# Altium project 剥皮器20200614.PrjPCB
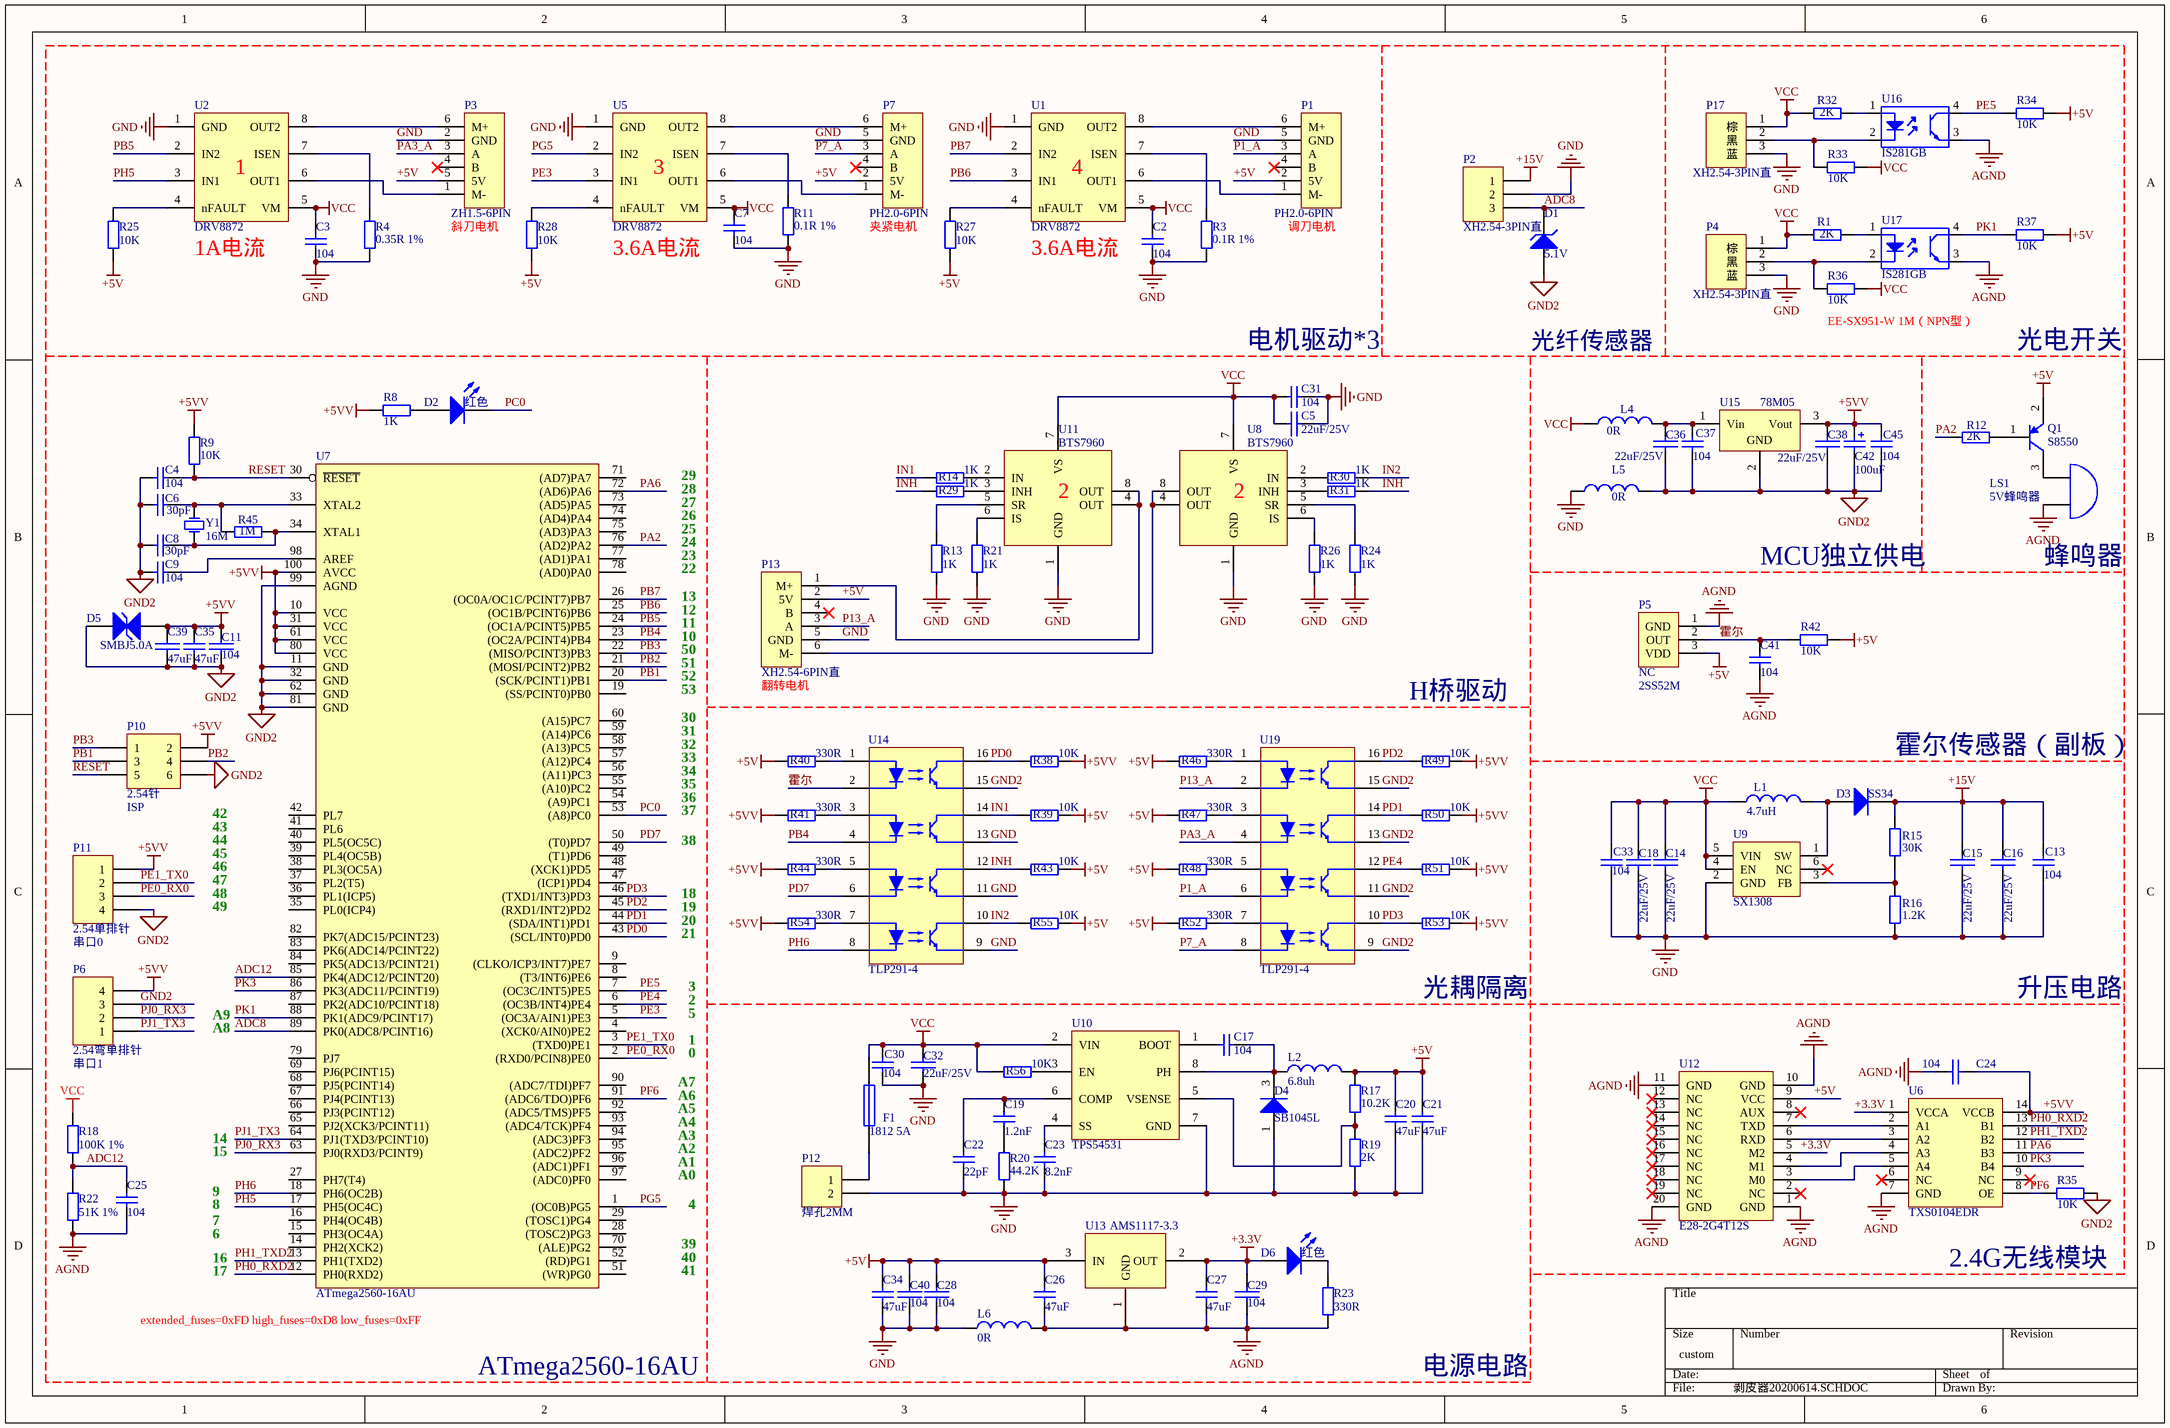
[diagram p0: 剥皮器20200614.SCHDOC]
1 sheet, 134 parts. Net scope: global (net labels, ports and power ports of the same name join across sheets).
Board file: 剥皮器20200614.PCBDOC

## Sheet 剥皮器20200614.SCHDOC
size 406 x 266 mm; PageSetup: Record=PageOptions|CenterHorizontal=True|CenterVertical=True|PrintScale=1.02|XCorrection=1.00|YCorrection=1.00|PrintKind=0|BorderSize=5000000|LeftOffset=0|BottomOffset=0|Orientation=2|PaperLength=1000|PaperWidth=1000|Scale=100|PaperSource=7|PrintQuality=-4|MediaType=1|DitherType=10|PaperKind=A3|PrintScaleMode=1

### Parts
C2  104  [0805-C]
C3  104  [0805-C]
C4  104  [0805-C]
C5  22uF/25V  [1206-C]
C6  30pF  [0805-C]
C7  104  [0805-C]
C8  30pF  [0805-C]
C9  104  [0805-C]
C11  104  [0805-C]
C13  104  [0805-C]
C14  22uF/25V  [1206-C]
C15  22uF/25V  [1206-C]
C16  22uF/25V  [1206-C]
C17  104  [0805-C]
C18  22uF/25V  [1206-C]
C19  1.2nF  [0805-C]
C20  47uF  [0805-C]
C21  47uF  [0805-C]
C22  22pF  [0805-C]
C23  8.2nF  [0805-C]
C24  104  [0805-C]
C25  104  [0805-C]
C26  47uF  [0805-C]
C27  47uF  [0805-C]
C28  104  [0805-C]
C29  104  [0805-C]
C30  104  [0805-C]
C31  104  [0805-C]
C32  22uF/25V  [1206-C]
C33  104  [0805-C]
C34  47uF  [0805-C]
C35  47uF  [0805-C]
C36  22uF/25V  [1206-C]
C37  104  [0805-C]
C38  22uF/25V  [1206-C]
C39  47uF  [0805-C]
C40  104  [0805-C]
C41  104  [0805-C]
C42  100uF  [LC-CASE-C_6032]
C45  104  [0805-C]
D1  5.1V  [LC-LL-34]
D2  红色  [0805-LED]
D3  SS34  [SMA - JW]
D4  SB1045L  [TO-277]
D5  SMBJ5.0A  [LC-SMB(DO-214AA)_S2]
D6  红色  [0805-LED]
F1  1812 5A  [LC-1812_R]
L1  4.7uH  [7*7*4电感]
L2  6.8uh  [7*7*4电感]
L4  0R  [0805-R]
L5  0R  [0805-R]
L6  0R  [0805-R]
LS1  5V蜂鸣器  [蜂鸣器0905]
P1  PH2.0-6PIN  [PH2.0-6PIN]
P2  XH2.54-3PIN直  [XH2.54-3PIN直]
P3  ZH1.5-6PIN  [ZH1.5-6PIN]
P4  XH2.54-3PIN直  [XH2.54-3PIN直]
P5  NC  Publisher: 2SS52M  [TO-92—_三极管]
P6  2.54弯单排针  [HDR1X4H]
P7  PH2.0-6PIN  [PH2.0-6PIN]
P10  2.54针  [HDR2X3]
P11  2.54单排针  [HDR1X4]
P12  焊孔2MM  [HDR1X2]
P13  XH2.54-6PIN直  [XH2.54-6PIN直]
P17  XH2.54-3PIN直  [XH2.54-3PIN直]
Q1  S8550  [SOT--23]
R1  2K  [0805-R]
R3  0.1R 1%  [2512-R]
R4  0.35R 1%  [2512-R]
R8  1K  [0805-R]
R9  10K  [0805-R]
R11  0.1R 1%  [2512-R]
R12  2K  [0805-R]
R13  1K  [0805-R]
R14  1K  [0805-R]
R15  30K  [0805-R]
R16  1.2K  [0805-R]
R17  10.2K  [0805-R]
R18  100K 1%  [0805-R]
R19  2K  [0805-R]
R20  44.2K  [0805-R]
R21  1K  [0805-R]
R22  51K 1%  [0805-R]
R23  330R  [0805-R]
R24  1K  [0805-R]
R25  10K  [0805-R]
R26  1K  [0805-R]
R27  10K  [0805-R]
R28  10K  [0805-R]
R29  1K  [0805-R]
R30  1K  [0805-R]
R31  1K  [0805-R]
R32  2K  [0805-R]
R33  10K  [0805-R]
R34  10K  [0805-R]
R35  10K  [0805-R]
R36  10K  [0805-R]
R37  10K  [0805-R]
R38  10K  [0805-R]
R39  10K  [0805-R]
R40  330R  [0805-R]
R41  330R  [0805-R]
R42  10K  [0805-R]
R43  10K  [0805-R]
R44  330R  [0805-R]
R45  1M  [0805-R]
R46  330R  [0805-R]
R47  330R  [0805-R]
R48  330R  [0805-R]
R49  10K  [0805-R]
R50  10K  [0805-R]
R51  10K  [0805-R]
R52  330R  [0805-R]
R53  10K  [0805-R]
R54  330R  [0805-R]
R55  10K  [0805-R]
R56  10K  [0805-R]
U1  DRV8872  [SOP-8带散热]
U2  DRV8872  [SOP-8带散热]
U5  DRV8872  [SOP-8带散热]
U6  TXS0104EDR  [LC-SOIC-14_150mil]
U7  ATmega2560-16AU  [LC-LQFP-100_14x14x05P]
U8  BTS7960  [LC-TO-263-7]
U9  SX1308  [SOT-23-6]
U10  TPS54531  [SOP-8带散热]
U11  BTS7960  [LC-TO-263-7]
U12  E28-2G4T12S  [E28-2G4T12S]
U13  AMS1117-3.3  [SOT--223]
U14  TLP291-4  [TLP291-4]
U15  78M05  [TO-252]
U16  IS281GB  [LC-SOP-4_P1.27]
U17  IS281GB  [LC-SOP-4_P1.27]
U19  TLP291-4  [TLP291-4]
Y1  16M  [LC-SMD-5032_2P]

### Nets
+3.3V: C27.2 C29.1 D6.1(A) U6.1(VCCA) U12.5(M2) U13.2(OUT)
+5V: C20.2 C21.2 C26.2 C28.1 C34.2 C40.1 L2.2 P1.2(5V) P3.5(5V) P5.3(VDD) P7.2(5V) P13.2(5V) Q1.2(E) R17.2 R25.1 R27.1 R28.1 R34.2 R37.2 R39.1 R40.2 R42.1 R43.1 R46.2 R47.2 R48.2 R52.2 R55.1 U12.9(VCC) U13.3(IN)
+5VV: C11.1 C24.2 C35.2 C38.1 C39.2 C42.1 C45.2 D5.1(A) P6.4 P10.2 P11.1 R8.2 R9.2 R38.1 R41.2 R44.2 R49.1 R50.1 R51.1 R53.1 R54.2 U6.14(VCCB) U7.10(VCC) U7.31(VCC) U7.61(VCC) U7.80(VCC) U7.100(AVCC) U15.3(Vout)
+15V: C13.1 C15.1 C16.1 D3.2(K) P2.1 R15.1
AGND: C24.1 C25.2 C26.1 C27.1 C29.2 C41.2 L6.2 LS1.2(B) P5.1(GND) R22.1 R23.2 U6.7(GND) U12.1(GND) U12.10(GND) U12.11(GND) U12.20(GND) U13.1(GND) U16.3 U17.3
GND: C2.2 C3.2 C5.2 C7.2 C13.2 C14.2 C15.2 C16.2 C18.2 C20.1 C21.1 C22.2 C23.2 C28.2 C30.1 C31.2 C32.2 C33.1 C34.1 C40.2 D4.1(A) L5.1 L6.1 P1.5(GND) P2.2 P3.2(GND) P4.3(蓝) P7.5(GND) P12.2 P13.5(GND) P17.3(蓝) R3.1 R4.1 R11.1 R13.1 R16.2 R19.1 R20.1 R21.1 R24.1 R26.1 U1.1(GND) U2.1(GND) U5.1(GND) U8.1(GND) U9.2(GND) U10.7(GND) U11.1(GND) U14.9(Emitter4) U14.11(Emitter3) U14.13(Emitter2)
GND2: C4.2 C6.2 C8.2 C9.2 C11.2 C35.1 C36.2 C37.1 C38.2 C39.1 C42.2 C45.1 D1.1(A) D5.2(K) L5.2 P6.3 P10.6 P11.4 R35.1 U7.11(GND) U7.32(GND) U7.62(GND) U7.81(GND) U7.99(AGND) U14.15(Emitter1) U15.2(GND) U19.9(Emitter4) U19.11(Emitter3) U19.13(Emitter2) U19.15(Emitter1)
VCC: C2.1 C3.1 C5.1 C7.1 C14.1 C18.1 C30.2 C31.1 C32.1 C33.2 F1.2 L1.1 L4.1 P4.1(棕) P17.1(棕) R1.1 R18.2 R32.1 R33.1 R36.1 R56.2 U1.5(VM) U2.5(VM) U5.5(VM) U8.7(VS) U9.4(EN) U9.5(VIN) U10.2(VIN) U11.7(VS)
ADC8: D1.2(K) P2.3 U7.89(PK0(ADC8/PCINT16))
ADC12: C25.1 R18.1 R22.2 U7.85(PK4(ADC12/PCINT20))
IN1: R14.2 R39.2 U14.14(Collector2)
IN2: R30.1 R55.2 U14.10(Collector4)
INH: R29.2 R31.1 R43.2 U14.12(Collector3)
P1_A: P1.3(A) U19.6(Cathode3)
P7_A: P7.3(A) U19.8(Cathode4)
P13_A: P13.3(A) U19.2(Cathode1)
PA2: R12.2 U7.76((AD2)PA2)
PA3_A: P3.3(A) U19.4(Cathode2)
PA6: U6.11(B3) U7.72((AD6)PA6)
PB1: P10.3 U7.20((SCK/PCINT1)PB1)
PB2: P10.4 U7.21((MOSI/PCINT2)PB2)
PB3: P10.1 U7.22((MISO/PCINT3)PB3)
PB4: U7.23((OC2A/PCINT4)PB4) U14.4(Cathode2)
PB5: U2.2(IN2) U7.24((OC1A/PCINT5)PB5)
PB6: U1.3(IN1) U7.25((OC1B/PCINT6)PB6)
PB7: U1.2(IN2) U7.26((OC0A/OC1C/PCINT7)PB7)
PC0: D2.2(K) U7.53((A8)PC0)
PD0: R38.2 U7.43((SCL/INT0)PD0) U14.16(Collector1)
PD1: R50.2 U7.44((SDA/INT1)PD1) U19.14(Collector2)
PD2: R49.2 U7.45((RXD1/INT2)PD2) U19.16(Collector1)
PD3: R53.2 U7.46((TXD1/INT3)PD3) U19.10(Collector4)
PD7: U7.50((T0)PD7) U14.6(Cathode3)
PE0_RX0: P11.3 U7.2((RXD0/PCIN8)PE0)
PE1_TX0: P11.2 U7.3((TXD0)PE1)
PE3: U5.3(IN1) U7.5((OC3A/AIN1)PE3)
PE4: R51.2 U7.6((OC3B/INT4)PE4) U19.12(Collector3)
PE5: R34.1 U7.7((OC3C/INT5)PE5) U16.4
PF6: R35.2 U6.8(OE) U7.91((ADC6/TDO)PF6)
PG5: U5.2(IN2) U7.1((OC0B)PG5)
PH0_RXD2: U6.13(B1) U7.12(PH0(RXD2))
PH1_TXD2: U6.12(B2) U7.13(PH1(TXD2))
PH5: U2.3(IN1) U7.17(PH5(OC4C))
PH6: U7.18(PH6(OC2B)) U14.8(Cathode4)
PJ0_RX3: P6.2 U7.63(PJ0(RXD3/PCINT9))
PJ1_TX3: P6.1 U7.64(PJ1(TXD3/PCINT10))
PK1: R37.1 U7.88(PK1(ADC9/PCINT17)) U17.4
PK3: U6.10(B4) U7.86(PK3(ADC11/PCINT19))
RESET: C4.1 P10.5 R9.1 U7.30(~{RESET})
霍尔: C41.1 P5.2(OUT) R42.2 U14.2(Cathode1)
NetC6_1: C6.1 R45.1 U7.33(XTAL2) Y1.1(OSC1)
NetC8_1: C8.1 R45.2 U7.34(XTAL1) Y1.2(OSC2)
NetC9_1: C9.1 U7.98(AREF)
NetC17_1: C17.1 U10.1(BOOT)
NetC17_2: C17.2 D4.3(K) L2.1 U10.8(PH)
NetC19_1: C19.1 C22.1 U10.6(COMP)
NetC19_2: C19.2 R20.2
NetC23_1: C23.1 U10.4(SS)
NetC36_1: C36.1 C37.2 L4.2 U15.1(Vin)
NetD2_1: D2.1(A) R8.1
NetD3_1: D3.1(A) L1.2 U9.1(SW)
NetD6_2: D6.2(K) R23.1
NetF1_1: F1.1 P12.1
NetLS1_1: LS1.1(A) Q1.3(C)
NetP1_1: P1.1(M-) U1.6(OUT1)
NetP1_6: P1.6(M+) U1.8(OUT2)
NetP3_1: P3.1(M-) U2.6(OUT1)
NetP3_6: P3.6(M+) U2.8(OUT2)
NetP4_2: P4.2(黑) R36.2 U17.2
NetP7_1: P7.1(M-) U5.6(OUT1)
NetP7_6: P7.6(M+) U5.8(OUT2)
NetP13_1: P13.1(M+) U11.4(OUT) U11.8(OUT)
NetP13_6: P13.6(M-) U8.4(OUT) U8.8(OUT)
NetP17_2: P17.2(黑) R33.2 U16.2
NetQ1_1: Q1.1(B) R12.1
NetR1_2: R1.2 U17.1
NetR3_2: R3.2 U1.7(ISEN)
NetR4_2: R4.2 U2.7(ISEN)
NetR11_2: R11.2 U5.7(ISEN)
NetR13_2: R13.2 U11.5(SR)
NetR14_1: R14.1 U11.2(IN)
NetR15_2: R15.2 R16.1 U9.3(FB)
NetR17_1: R17.1 R19.2 U10.5(VSENSE)
NetR21_2: R21.2 U11.6(IS)
NetR24_2: R24.2 U8.5(SR)
NetR25_2: R25.2 U2.4(nFAULT)
NetR26_2: R26.2 U8.6(IS)
NetR27_2: R27.2 U1.4(nFAULT)
NetR28_2: R28.2 U5.4(nFAULT)
NetR29_1: R29.1 U11.3(INH)
NetR30_2: R30.2 U8.2(IN)
NetR31_2: R31.2 U8.3(INH)
NetR32_2: R32.2 U16.1
NetR40_1: R40.1 U14.1(Anode1)
NetR41_1: R41.1 U14.3(Anode2)
NetR44_1: R44.1 U14.5(Anode3)
NetR46_1: R46.1 U19.1(Anode1)
NetR47_1: R47.1 U19.3(Anode2)
NetR48_1: R48.1 U19.5(Anode3)
NetR52_1: R52.1 U19.7(Anode4)
NetR54_1: R54.1 U14.7(Anode4)
NetR56_1: R56.1 U10.3(EN)
NetU6_2: U6.2(A1) U12.7(TXD)
NetU6_3: U6.3(A2) U12.6(RXD)
NetU6_4: U6.4(A3) U12.4(M1)
NetU6_5: U6.5(A4) U12.3(M0)

Not connected (* = marked no-connect by the designer): P1 4(B)*; P3 4(B)*; P7 4(B)*; P13 4(B)*; U6 6(NC)* 9(NC)*; U7 4((XCK0/AIN0)PE2) 8((T3/INT6)PE6) 9((CLKO/ICP3/INT7)PE7) 14(PH2(XCK2)) 15(PH3(OC4A)) 16(PH4(OC4B)) 19((SS/PCINT0)PB0) 27(PH7(T4)) 28((TOSC2)PG3) 29((TOSC1)PG4) 35(PL0(ICP4)) 36(PL1(ICP5)) 37(PL2(T5)) 38(PL3(OC5A)) 39(PL4(OC5B)) 40(PL5(OC5C)) 41(PL6) 42(PL7) 47((ICP1)PD4) 48((XCK1)PD5) 49((T1)PD6) 51((WR)PG0) 52((RD)PG1) 54((A9)PC1) 55((A10)PC2) 56((A11)PC3) 57((A12)PC4) 58((A13)PC5) 59((A14)PC6) 60((A15)PC7) 65(PJ2(XCK3/PCINT11)) 66(PJ3(PCINT12)) 67(PJ4(PCINT13)) 68(PJ5(PCINT14)) 69(PJ6(PCINT15)) 70((ALE)PG2) 71((AD7)PA7) 73((AD5)PA5) 74((AD4)PA4) 75((AD3)PA3) 77((AD1)PA1) 78((AD0)PA0) 79(PJ7) 82(PK7(ADC15/PCINT23)) 83(PK6(ADC14/PCINT22)) 84(PK5(ADC13/PCINT21)) 87(PK2(ADC10/PCINT18)) 90((ADC7/TDI)PF7) 92((ADC5/TMS)PF5) 93((ADC4/TCK)PF4) 94((ADC3)PF3) 95((ADC2)PF2) 96((ADC1)PF1) 97((ADC0)PF0); U9 6(NC)*; U12 2(NC)* 8(AUX)* 12(NC)* 13(NC)* 14(NC)* 15(NC)* 16(NC)* 17(NC)* 18(NC)* 19(NC)*

### Notes on the sheet
- (near U2) 1
- (near P3) 斜刀电机
- (near U5) 3
- (near P7) 夹紧电机
- (near U1) 4
- (near P1) 调刀电机
- (near U2) 1A电流
- (near U5) 3.6A电流
- (near U1) 3.6A电流
- (near C31) 电机驱动*3
- 光纤传感器
- (near R36) EE-SX951-W 1M（NPN型）
- 光电开关
- 27
- 28
- 29
- (near U11) 2
- (near U8) 2
- 22
- 23
- 24
- 25
- 26
- MCU独立供电
- (near LS1) 蜂鸣器
- 10
- 11
- 12
- 13
- 53
- 52
- 51
- 50
- (near P13) 翻转电机
- H桥驱动
- 34
- 33
- 32
- 31
- 30
- 霍尔传感器（副板）
- (near P10) 42
- 43
- 37
- 36
- 35
- 44
- 45
- 46
- 47
- 48
- 49
- 19
- 18
- 38
- 21
- 20
- A8
- A9
- 1
- 5
- 2
- 3
- 光耦隔离
- 升压电路
- A5
- A6
- A7
- 0
- 14
- 15
- A0
- A1
- A2
- A3
- A4
- 9
- 8
- 7
- 6
- 39
- 4
- 16
- 17
- 40
- 41
- 2.4G无线模块
- (near U7) extended_fuses=0xFD high_fuses=0xD8 low_fuses=0xFF
- ATmega2560-16AU
- 电源电路
- (in symbol Header 3X2) ISP

### Library data of the parts
C2-C4 C7-C9 C13 C17 C19-C23 C25-C27 C30 C31 C33-C35 C37 C41 C45 = Cap: Capacitor; Published: 8-Jun-2000; LatestRevisionDate: 17-Jul-2002; LatestRevisionNote: Re-released for DXP Platform.; Publisher: Altium Limited
  C2-C4 C7 C17 C19-C23 C25-C27 C30 C31 C33-C35 C37 C41 C45: PackageReference: RAD-0.3
  C13: PackageReference: RAD-0.3; Value: 104
C5 C11 C14-C16 C18 C24 C28 C29 C32 C36 C38-C40 = CAP: Capacitor
C6 = Cap: Capacitor; Value: 30P; Published: 8-Jun-2000; LatestRevisionDate: 17-Jul-2002; LatestRevisionNote: Re-released for DXP Platform.; Publisher: Altium Limited
C42 = Cap Pol2: Polarized Capacitor (Axial); Value: 100pF; Published: 8-Jun-2000; LatestRevisionDate: 17-Jul-2002; LatestRevisionNote: Re-released for DXP Platform.; PackageReference: POLAR0.8; Publisher: Altium Limited
D1 = D Zener: Zener Diode; Published: 8-Jun-2000; LatestRevisionDate: 17-Jul-2002; LatestRevisionNote: Re-released for DXP Platform.; PackageReference: DIODE-0.7; Publisher: Altium Limited
D2 D6 = LED0: Typical INFRARED GaAs LED; Published: 8-Jun-2000; LatestRevisionDate: 08-Jul-2005; LatestRevisionNote: Mech Layer 1 removed.; PackageReference: LED-0; Publisher: Altium Limited
D3 = Diode 1N4007: 1 Amp General Purpose Rectifier; Published: 8-Jun-2000; LatestRevisionDate: 17-Jul-2002; LatestRevisionNote: Re-released for DXP Platform.; DatasheetDocument: 1998; PackageDocument: Aug-1999; PackageReference: DO-41; Publisher: Altium Limited; Code_JEDEC: DO-204-AL; ComponentLink1Description: Manufacturer Link; ComponentLink1URL: http://www.fairchildsemi.com/; ComponentLink2Description: Datasheet; ComponentLink2URL: http://www.fairchildsemi.com/ds/1N%2F1N4001.pdf
D4 = Diode 1N4001: 1 Amp General Purpose Rectifier; Published: 8-Jun-2000; LatestRevisionDate: 17-Jul-2002; LatestRevisionNote: Re-released for DXP Platform.; DatasheetDocument: 1998; PackageDocument: Aug-1999; PackageReference: DO-41; Publisher: Altium Limited; Code_JEDEC: DO-204-AL; ComponentLink1Description: Manufacturer Link; ComponentLink1URL: http://www.fairchildsemi.com/; ComponentLink2Description: Datasheet; ComponentLink2URL: http://www.fairchildsemi.com/ds/1N%2F1N4001.pdf
D5 = TVS
F1 = Fuse 1: Fuse; Published: 8-Jun-2000; LatestRevisionDate: 17-Jul-2002; LatestRevisionNote: Re-released for DXP Platform.; PackageReference: PIN-W2/E2.8; Publisher: Altium Limited
L1 = Inductor: Code_IEC: 1005; Published: 8-Jun-2000; LatestRevisionDate: 17-Jul-2002; LatestRevisionNote: Re-released for DXP Platform.; PackageReference: 0402-A; Publisher: Altium Limited; Code_JEITA: 0402
L2 L4-L6 = Inductor: Code_IEC: 1005; Value: 10mH; Published: 8-Jun-2000; LatestRevisionDate: 17-Jul-2002; LatestRevisionNote: Re-released for DXP Platform.; PackageReference: 0402-A; Publisher: Altium Limited; Code_JEITA: 0402
LS1 = Bell: Electrical Bell; Published: 24-Mar-1999; LatestRevisionDate: 17-Jul-2002; LatestRevisionNote: Re-released for DXP Platform.; Publisher: Altium Limited
P1 P3 P7 P13 = Header 6: Header, 6-Pin; LatestRevisionDate: 17-Jul-2002; LatestRevisionNote: Re-released for DXP Platform.; Publisher: Altium Limited
P2 P4 P5 P17 = Header 3: Header, 3-Pin; LatestRevisionDate: 17-Jul-2002; LatestRevisionNote: Re-released for DXP Platform.
  P2 P4 P17: Publisher: Altium Limited
P6 P11 = Header 4: Header, 4-Pin; LatestRevisionDate: 17-Jul-2002; LatestRevisionNote: Re-released for DXP Platform.; Publisher: Altium Limited
P10 = Header 3X2: Header, 3-Pin, Dual row; LatestRevisionDate: 17-Jul-2002; LatestRevisionNote: Re-released for DXP Platform.; Publisher: Altium Limited
P12 = Header 2: Header, 2-Pin; LatestRevisionDate: 17-Jul-2002; LatestRevisionNote: Re-released for DXP Platform.; Publisher: Altium Limited
Q1 = 2N3906: PNP General Purpose Amplifier; Published: 8-Jun-2000; LatestRevisionDate: 15-Jan-2003; LatestRevisionNote: PCB Footprint 'BCY-W3/D4.7' replaced; DatasheetDocument: 1997; PackageDocument: Sep-1998; PackageReference: TO-92A; Publisher: Altium Limited; Code_JEDEC: TO-92A; ComponentLink1Description: Manufacturer Link; ComponentLink1URL: http://www.fairchildsemi.com/; ComponentLink2Description: Datasheet; ComponentLink2URL: http://www.fairchildsemi.com/ds/2N%2F2N3906.pdf
R1 R9 R12-R16 R18 R21 R22 R24 R26 R29-R32 R35 R38-R56 = Res2: Resistor; Published: 8-Jun-2000; LatestRevisionDate: 17-Jul-2002; LatestRevisionNote: Re-released for DXP Platform.; PackageReference: AXIAL-0.4; Publisher: Altium Limited
  R1 R12 R32: Value: 2K
  R9 R42: Value: 10K
R3 R4 R8 R11 R17 R19 R20 R23 = Res2: Resistor; Value: 10K; Published: 8-Jun-2000; LatestRevisionDate: 17-Jul-2002; LatestRevisionNote: Re-released for DXP Platform.; PackageReference: AXIAL-0.4; Publisher: Altium Limited
R25 R27 R28 = Res2: Resistor; Value: 47K; Published: 8-Jun-2000; LatestRevisionDate: 17-Jul-2002; LatestRevisionNote: Re-released for DXP Platform.; Publisher: Altium Limited
R33 R34 R36 R37 = Res2: Resistor; Value: 2K; Published: 8-Jun-2000; LatestRevisionDate: 17-Jul-2002; LatestRevisionNote: Re-released for DXP Platform.; PackageReference: AXIAL-0.4; Publisher: Altium Limited
U1 U2 U5 = 6N137
U7 = Arduino MEGA 2560
U12 = E43-433T13S
U13 = AS1117
U14 U19 = TLP291-4: Photocouplers GaAs Infrared LED & Photo Transistor
U15 = Volt Reg: Voltage Regulator; Published: 24-Mar-1999; LatestRevisionDate: 17-Jul-2002; LatestRevisionNote: Re-released for DXP Platform.; PackageReference: D2PAK; Publisher: Altium Limited; Code_JEDEC: SMD-220
U16 U17 = TLP521-1
Y1 = XTAL: Crystal Oscillator; Published: 8-Jun-2000; LatestRevisionDate: 17-Jul-2002; LatestRevisionNote: Re-released for DXP Platform.; Publisher: Altium Limited